# EAGLE design untitled1 (EAGLE 9.5.2)
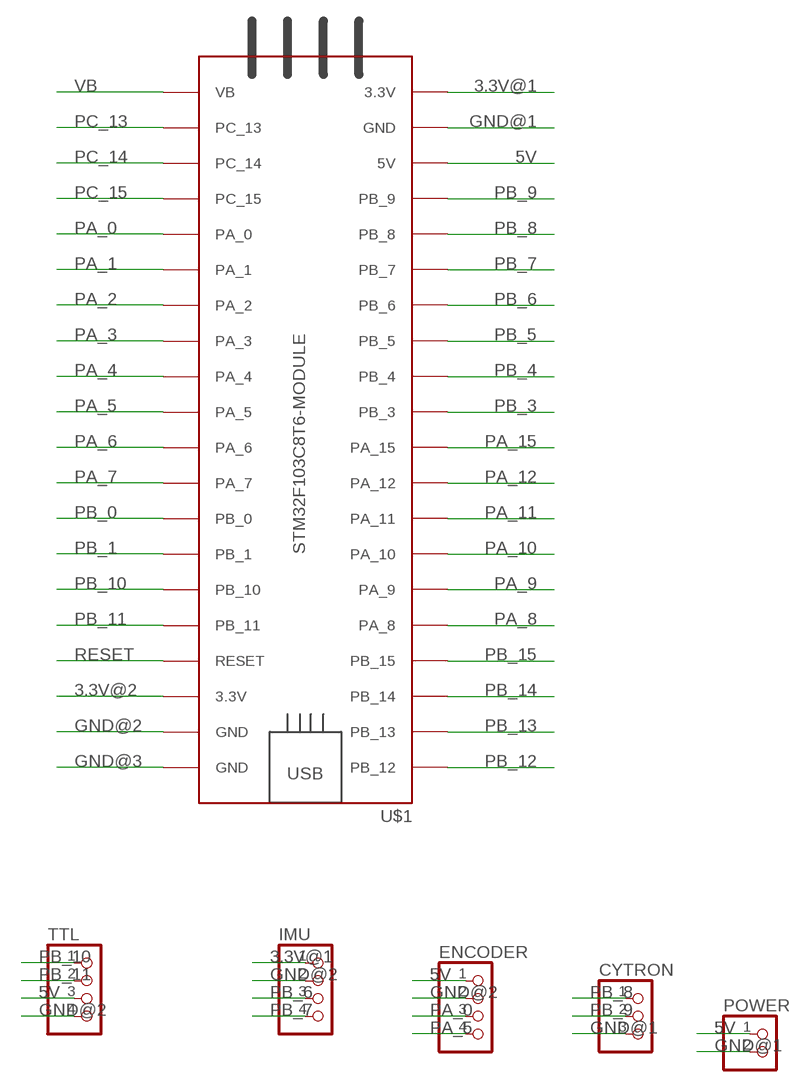
[diagram p0: schematic, sheet 1]

## Parts
CYTRON  PINHD-1X3  [1X03]
ENCODER  PINHD-1X4  [1X04]
IMU  PINHD-1X4  [1X04]
POWER  PINHD-1X2  [1X02]
TTL  PINHD-1X4  [1X04]
U$1  STM32F103C8T6-MODULE  [STM32F103C8T6-MODULE]

## Nets
3.3V@1: IMU.1 U$1.3.3V_1(3.3V)
3.3V@2: U$1.3.3V_2(3.3V)
5V: ENCODER.1 POWER.1 TTL.3 U$1.5V
GND@1: CYTRON.3 POWER.2 U$1.GND_1(GND)
GND@2: ENCODER.2 IMU.2 TTL.4 U$1.GND_2(GND)
GND@3: U$1.GND_3(GND)
PA_0: ENCODER.3 U$1.PA_0
PA_1: U$1.PA_1
PA_2: U$1.PA_2
PA_3: U$1.PA_3
PA_4: U$1.PA_4
PA_5: ENCODER.4 U$1.PA_5
PA_6: U$1.PA_6
PA_7: U$1.PA_7
PA_8: U$1.PA_8
PA_9: U$1.PA_9
PA_10: U$1.PA_10
PA_11: U$1.PA_11
PA_12: U$1.PA_12
PA_15: U$1.PA_15
PB_0: U$1.PB_0
PB_1: U$1.PB_1
PB_3: U$1.PB_3
PB_4: U$1.PB_4
PB_5: U$1.PB_5
PB_6: IMU.3 U$1.PB_6
PB_7: IMU.4 U$1.PB_7
PB_8: CYTRON.1 U$1.PB_8
PB_9: CYTRON.2 U$1.PB_9
PB_10: TTL.1 U$1.PB_10
PB_11: TTL.2 U$1.PB_11
PB_12: U$1.PB_12
PB_13: U$1.PB_13
PB_14: U$1.PB_14
PB_15: U$1.PB_15
PC_13: U$1.PC_13
PC_14: U$1.PC_14
PC_15: U$1.PC_15
RESET: U$1.RESET
VB: U$1.VB

## Library data of the parts
CYTRON = MIA_LIBRARY-2-2-2:PINHD-1X3: PIN HEADER
ENCODER IMU TTL = MIA_LIBRARY-2-2-2:PINHD-1X4: PIN HEADER
POWER = MIA_LIBRARY-2-2-2:PINHD-1X2: PIN HEADER
U$1 = MIA_LIBRARY-2-2-2:STM32F103C8T6-MODULE: STM32F103C8T6 module with ARM Cortex-3, 20kB SRAM, 64kB Flash, 72MHz

## Board
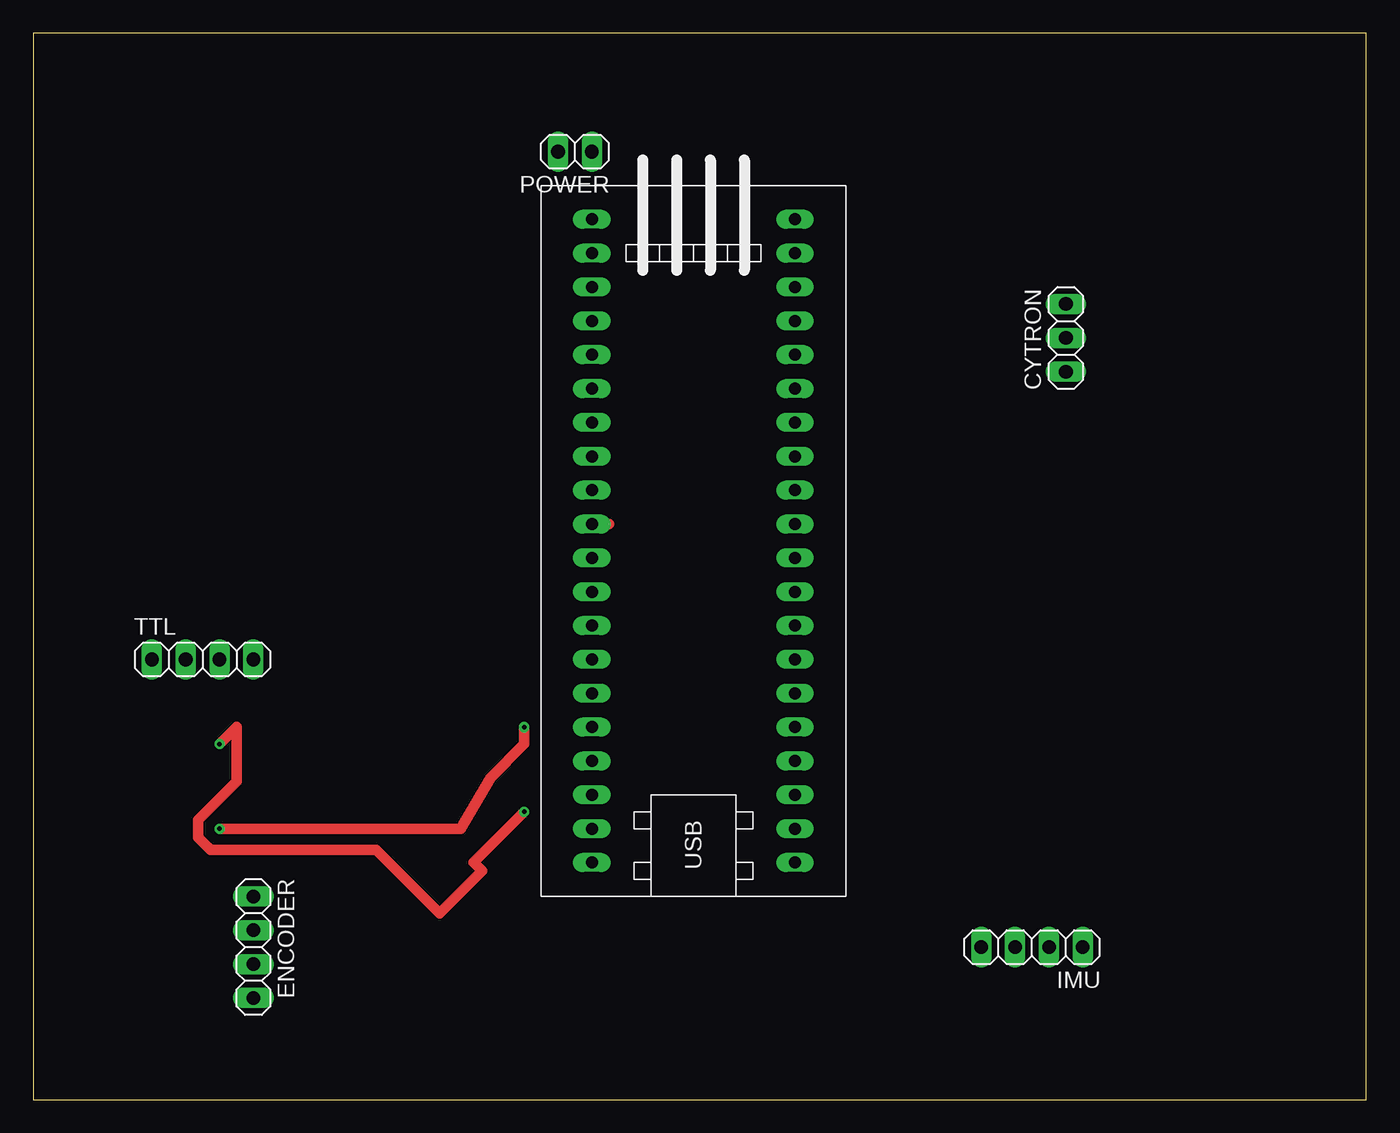
[diagram p1: board, top side]
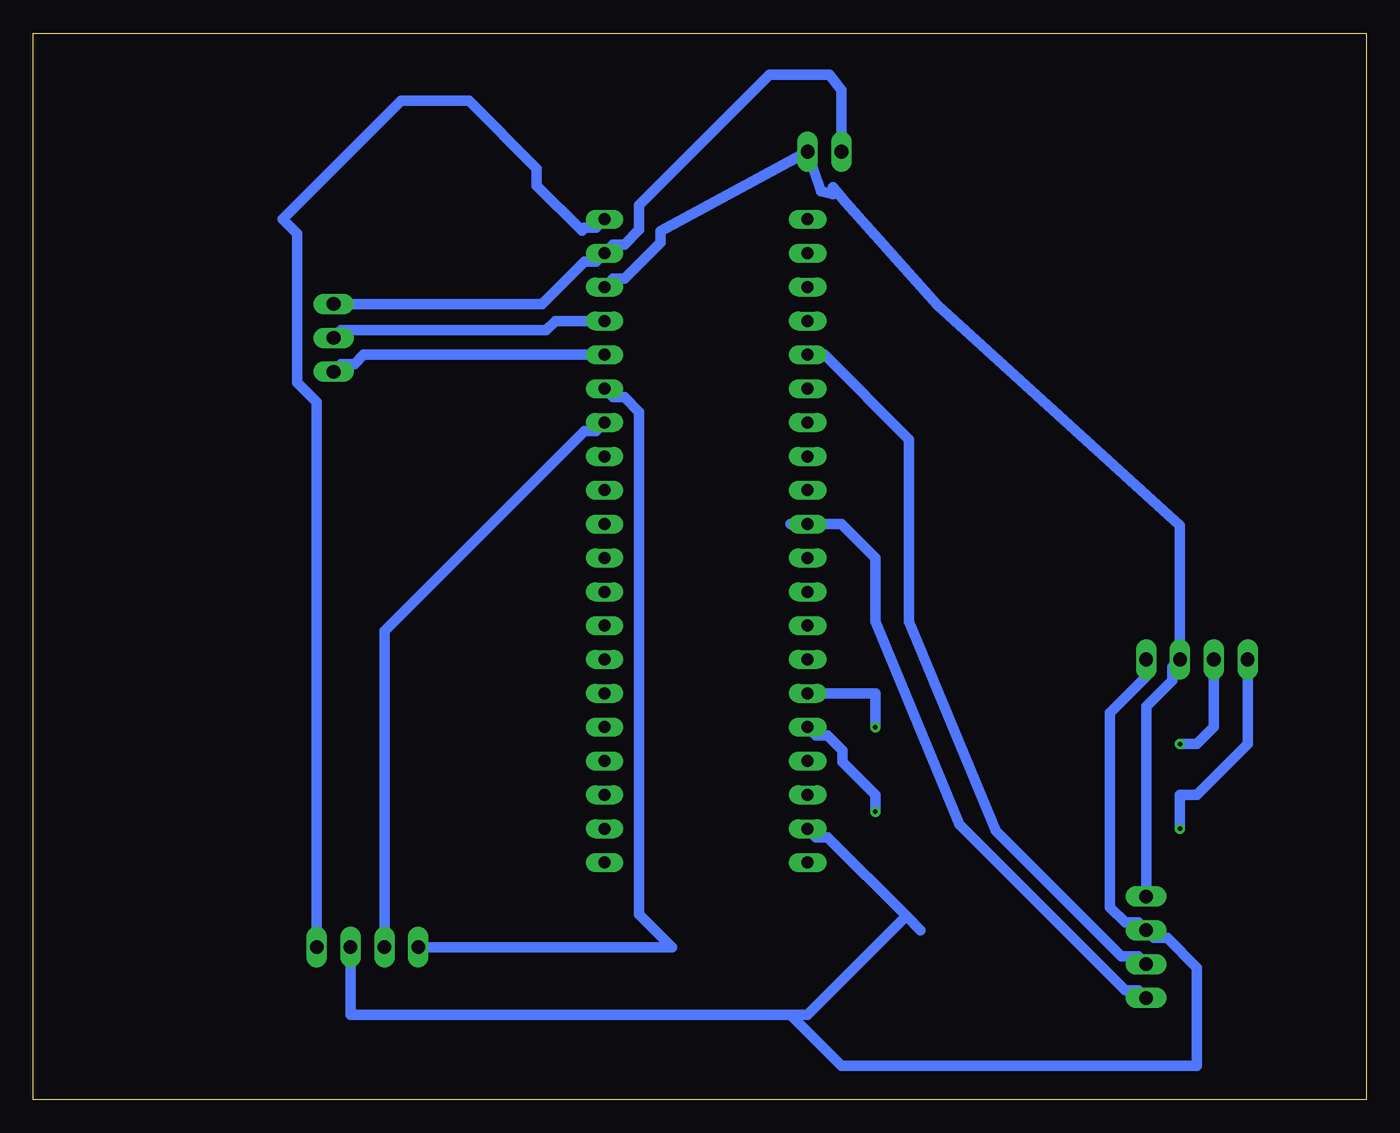
[diagram p2: board, bottom side, seen from below]

Size 100 x 80 mm. Coordinates in mm from the lower left corner, seen from the top.
Outline: 0,80 0,0 100,0 100,80 0,80
Copper layers (1*16): Top 0.035mm / dielectric 1.5mm / Bottom 0.035mm
Design rules "default *": minimum track width 0.8mm, minimum drill 0.35mm, track to track 0.8mm, track to pad 0.8mm, pad to pad 6mil, via to via 6mil, smd to smd 6mil, copper to edge 0.8mm, drill to drill 0.8mm, minimum pad ring 10mil, minimum via ring 8mil, stop-mask expansion 4mil, vias tented up to drill 0mil, thermal gap 10mil

### Footprints (pad centres in the part's own frame; a part is rotated, then mirrored left to right if it is on the bottom)
1X03 = drill 1.016 long: 1 -2.54,0; 2 0,0; 3 2.54,0
1X04 = drill 1.016 long: 1 -3.81,0; 2 -1.27,0; 3 1.27,0; 4 3.81,0
1X02 = drill 1.016 long: 1 -1.27,0; 2 1.27,0
STM32F103C8T6-MODULE = drill 0.9 long: 3.3V_1 25.4,-7.62; 3.3V_2 -17.78,7.62; 5V 20.32,-7.62; GND_1 22.86,-7.62; GND_2 -20.32,7.62; GND_3 -22.86,7.62; PA_0 15.24,7.62; PA_1 12.7,7.62; PA_2 10.16,7.62; PA_3 7.62,7.62; PA_4 5.08,7.62; PA_5 2.54,7.62; PA_6 0,7.62; PA_7 -2.54,7.62; PA_8 -12.7,-7.62; PA_9 -10.16,-7.62; PA_10 -7.62,-7.62; PA_11 -5.08,-7.62; PA_12 -2.54,-7.62; PA_15 0,-7.62; PB_0 -5.08,7.62; PB_1 -7.62,7.62; PB_3 2.54,-7.62; PB_4 5.08,-7.62; PB_5 7.62,-7.62; PB_6 10.16,-7.62; PB_7 12.7,-7.62; PB_8 15.24,-7.62; PB_9 17.78,-7.62; PB_10 -10.16,7.62; PB_11 -12.7,7.62; PB_12 -22.86,-7.62; PB_13 -20.32,-7.62; PB_14 -17.78,-7.62; PB_15 -15.24,-7.62; PC_13 22.86,7.62; PC_14 20.32,7.62; PC_15 17.78,7.62; RESET -15.24,7.62; VB 25.4,7.62

### Placement (x,y rotation side)
CYTRON  77.47,57.15 90 top
ENCODER  16.51,11.43 270 top
IMU  74.93,11.43 180 top
POWER  40.64,71.12 180 top
TTL  12.7,33.02 0 top
U$1  49.53,40.64 90 top

### Tracks (layer width: path | path; a pad name or v marks a point on that pad's centre or on a via)
3.3V@1
  Bottom 0.8: IMU.1 78.74,52.34 80.19,53.8 80.19,64.95 81.28,66.04 72.39,74.93 67.31,74.93 62.23,69.85 62.23,68.58 58.85,65.2 58.64,65.4 57.79,65.4 U$1.3.3V_1
5V
  Bottom 0.8: U$1.5V 56.51,61.6 55.66,61.6 52.94,64.31 52.94,65.17 POWER.1 40.92,68.16 40.01,67.94 40,67.95 40,68.47 39.04,67.31 32.16,59.6 13.97,43.06 TTL.3 14.55,32.44 14.55,31.45 16.51,29.48 ENCODER.1
GND@1
  Bottom 0.8: CYTRON.3 61.82,59.69 58.64,62.86 57.79,62.86 U$1.GND_1 56.51,64.14 55.66,64.14 54.54,65.25 54.54,67.11 44.76,76.89 40.25,76.89 39.37,75.73 POWER.2
GND@2
  Bottom 0.8: U$1.GND_2 41.27,19.68 40.42,19.68 34.5,13.76 | 34.5,13.76 33.43,12.7 | 34.5,13.76 41.91,6.35 43.18,6.35 | 43.18,6.35 76.2,6.35 IMU.2 | 43.18,6.35 39.37,2.54 12.7,2.54 12.7,9.89 14.94,12.12 15.93,12.12 ENCODER.2 17.09,13.28 18.09,13.28 19.23,14.43 19.23,29.02 16.51,31.75 TTL.4
PA_0
  Bottom 0.8: ENCODER.3 17.09,10.74 18.36,10.74 27.79,20.17 34.29,35.87 34.29,49.53 40.64,55.88 U$1.PA_0
PA_5  (1 unrouted)
  Top 0.8: 43.2,43.2 42.4,43.2 U$1.PA_5
  Bottom 0.8: ENCODER.4 17.09,8.2 18.09,8.2 30.52,20.63 36.83,35.87 36.83,40.64 39.37,43.18 43.18,43.18
PB_6
  Bottom 0.8: U$1.PB_6 57.79,50.16 58.64,50.16 73.66,35.15 IMU.3
PB_7
  Bottom 0.8: U$1.PB_7 56.51,52.7 55.66,52.7 54.54,51.59 54.54,13.9 52.07,11.43 IMU.4
PB_8
  Bottom 0.8: U$1.PB_8 75.2,55.88 75.89,55.19 76.89,55.19 CYTRON.1
PB_9
  Bottom 0.8: U$1.PB_9 60.82,58.42 61.52,57.73 76.89,57.73 CYTRON.2
PB_10  (via drill 0.35)
  Top 0.8: v13.97,20.32 32.06,20.32 34.29,24.13 36.83,26.67 v36.83,27.94
  Bottom 0.8: TTL.1 8.89,26.67 12.7,22.86 13.97,22.86 v13.97,20.32 | v36.83,27.94 36.83,30.48 U$1.PB_10
PB_11  (via drill 0.35)
  Top 0.8: v13.97,26.67 15.24,27.94 15.24,23.85 12.37,20.98 12.37,19.66 13.31,18.72 25.73,18.72 30.48,13.97 33.66,17.14 33.02,17.78 v36.83,21.59
  Bottom 0.8: TTL.2 11.43,27.94 12.7,26.67 v13.97,26.67 | v36.83,21.59 36.83,22.86 39.3,25.33 39.3,26.19 40.42,27.3 41.27,27.3 U$1.PB_11